# EAGLE design mainboard_v3 (EAGLE 9.6.2)

## Sheet 1 of 2
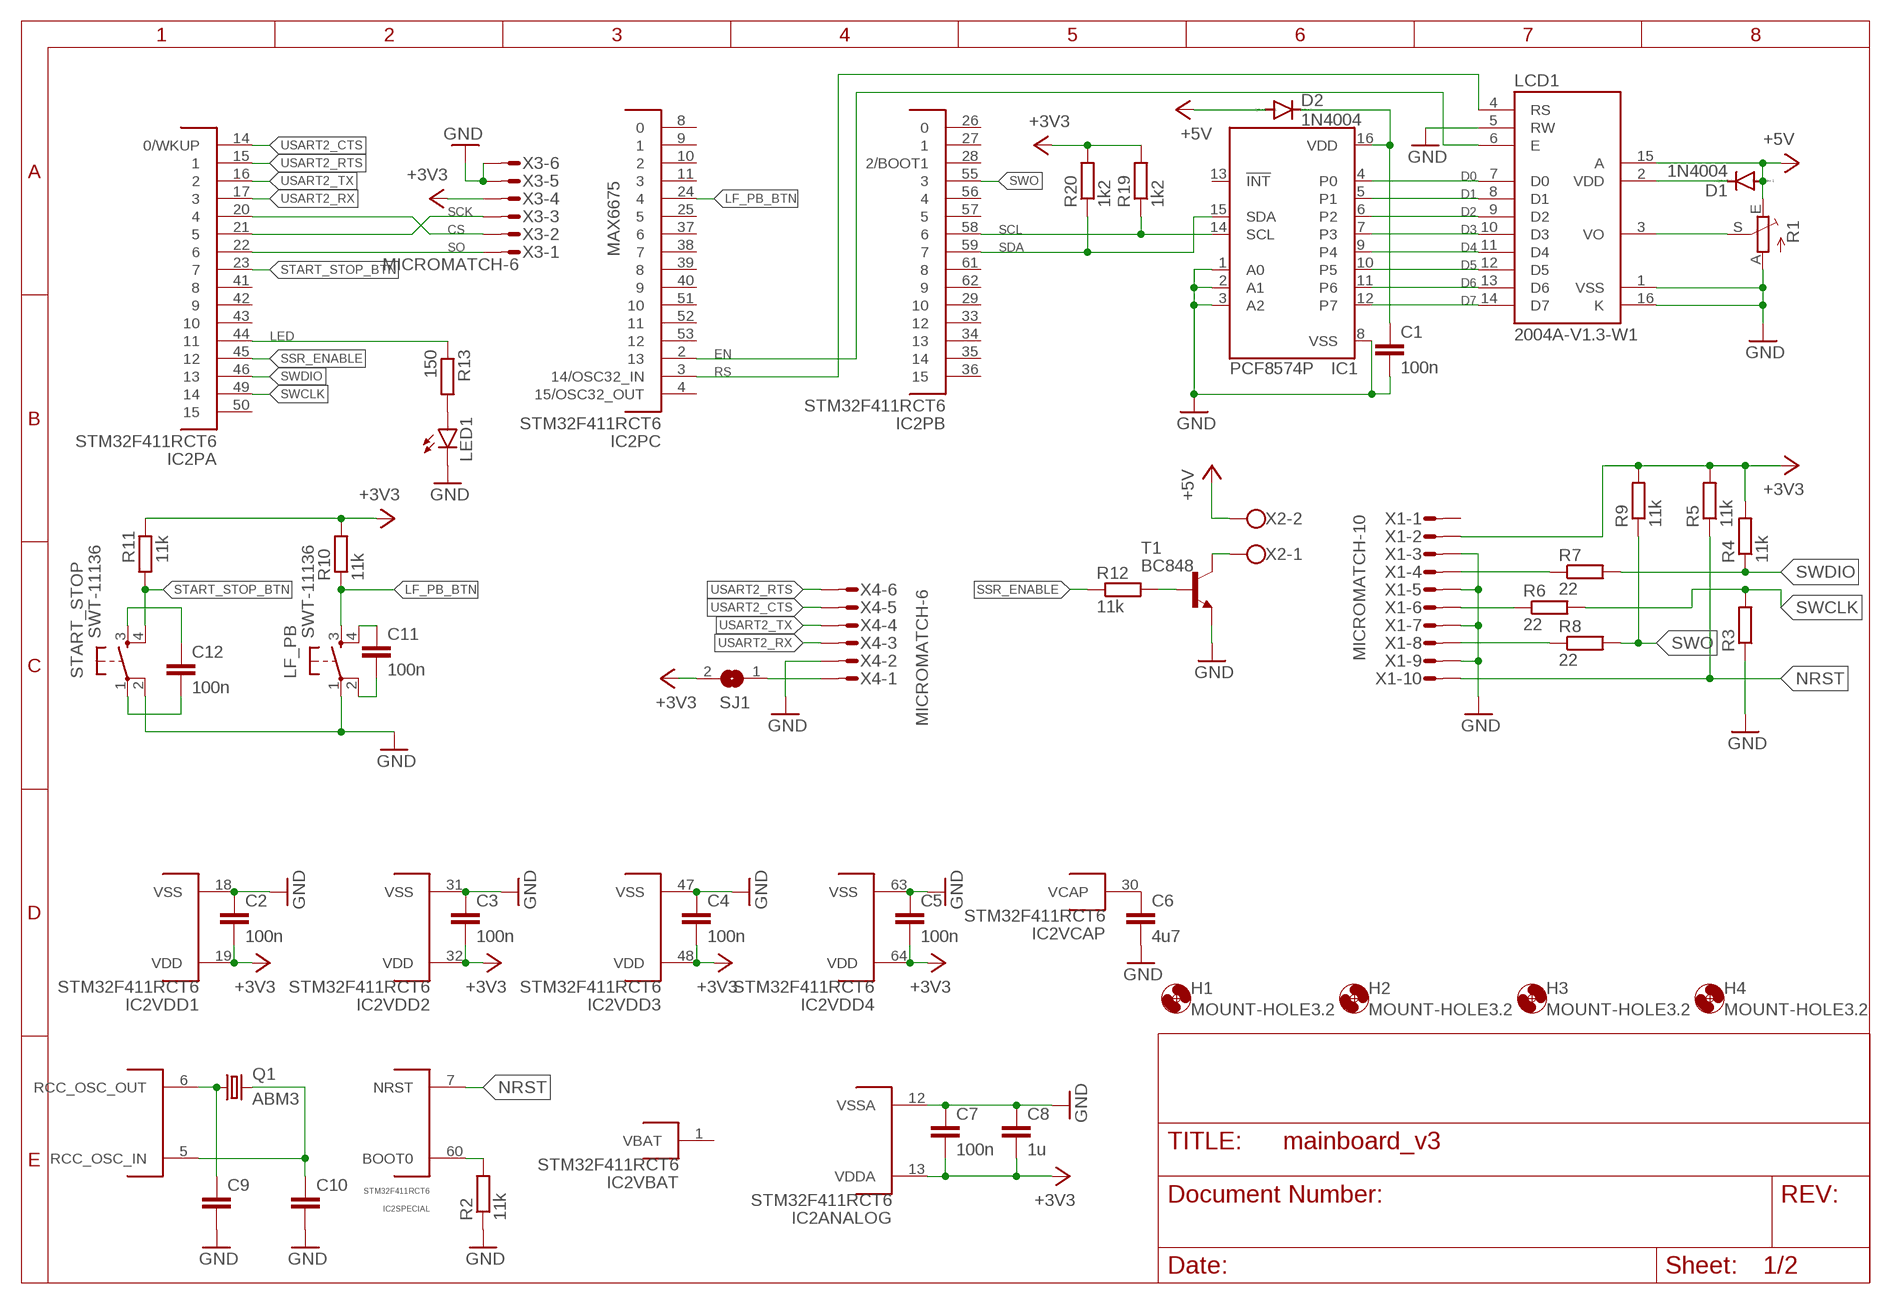
[diagram p0: schematic, sheet 1]

### Parts
C1  100n  C-EUC0805  [C0805]
C2  100n  C-EUC0805  [C0805]
C3  100n  C-EUC0805  [C0805]
C4  100n  C-EUC0805  [C0805]
C5  100n  C-EUC0805  [C0805]
C6  4u7  C-EUC0805  [C0805]
C7  100n  C-EUC0805  [C0805]
C8  1u  C-EUC0805  [C0805]
C9  C-EUC0805  [C0805]
C10  C-EUC0805  [C0805]
C11  100n  C-EUC0805  [C0805]
C12  100n  C-EUC0805  [C0805]
D1  1N4004  [DO41-10]
D2  1N4004  [DO41-10]
H1  MOUNT-HOLE3.2  [3,2]
H2  MOUNT-HOLE3.2  [3,2]
H3  MOUNT-HOLE3.2  [3,2]
H4  MOUNT-HOLE3.2  [3,2]
IC1  PCF8574P  [DIL16]
IC2  STM32F411RCT6  [QFP50P1200X1200X160-64N]
LCD1  2004A-V1.3-W1  [2004A-V1.3-W1]
LED1  LED5MM  [LED5MM]
LF_PB  SWT-11136  [SWT-11136]
Q1  ABM3  [XTALDFN500X320X130-2N]
R1  TRIM_EU-CA9V  [CA9V]
R2  11k  R-EU_R1206  [R1206]
R3  R-EU_R1206  [R1206]
R4  11k  R-EU_R1206  [R1206]
R5  11k  R-EU_R1206  [R1206]
R6  22  R-EU_R0603  [R0603]
R7  22  R-EU_R0603  [R0603]
R8  22  R-EU_R0603  [R0603]
R9  11k  R-EU_R1206  [R1206]
R10  11k  R-EU_R1206  [R1206]
R11  11k  R-EU_R1206  [R1206]
R12  11k  R-EU_R1206  [R1206]
R13  150  R-EU_R0805  [R0805]
R19  1k2  R-EU_0207/12  [0207/12]
R20  1k2  R-EU_0207/12  [0207/12]
SJ1  SJ  [SJ]
START_STOP  SWT-11136  [SWT-11136]
T1  BC848  [SOT23]
X1  MICROMATCH-10  [MICROMATCH-10]
X2  W237-102  [W237-102]
X3  MICROMATCH-6  [MICROMATCH-6]
X4  MICROMATCH-6  [MICROMATCH-6]

### Nets
+3V3 [power]: C2.2 C3.2 C4.2 C5.2 C7.2 C8.2 IC2.13(ANALOG:VDDA) IC2.19(VDD1:VDD) IC2.32(VDD2:VDD) IC2.48(VDD3:VDD) IC2.64(VDD4:VDD) R4.2 R5.2 R9.2 R10.2 R11.2 R19.2 R20.2 SJ1.2 X1.2 X3.4 ; also sheet 2
+5V [power]: D1.A D2.A LCD1.15(A) R1.E X2.2 ; also sheet 2
CS [signal]: IC2.20 X3.2
D0 [signal_wide]: IC1.4(P0) LCD1.7(D0)
D1 [signal_wide]: IC1.5(P1) LCD1.8(D1)
D2 [signal_wide]: IC1.6(P2) LCD1.9(D2)
D3 [signal_wide]: IC1.7(P3) LCD1.10(D3)
D4 [signal_wide]: IC1.9(P4) LCD1.11(D4)
D5 [signal_wide]: IC1.10(P5) LCD1.12(D5)
D6 [signal_wide]: IC1.11(P6) LCD1.13(D6)
D7 [signal_wide]: IC1.12(P7) LCD1.14(D7)
EN [signal]: IC2.2 LCD1.6(E)
GND: C1.2 C2.1 C3.1 C4.1 C5.1 C6.2 C7.1 C8.1 C9.2 C10.2 IC1.1(A0) IC1.2(A1) IC1.3(A2) IC1.8(VSS) IC2.12(ANALOG:VSSA) IC2.18(VDD1:VSS) IC2.31(VDD2:VSS) IC2.47(VDD3:VSS) IC2.63(VDD4:VSS) LCD1.1(VSS) LCD1.5(RW) LCD1.16(K) LED1.K(C) LF_PB.1(P) R1.A R2.1 R3.1 START_STOP.2(P1) T1.2(E) X1.3 X1.5 X1.7 X1.9 X3.5 X3.6 X4.2 ; also sheet 2
LED: IC2.44 R13.1
LF_PB_BTN [signal]: IC2.24 LF_PB.3(S) R10.1
N$1: IC2.60(SPECIAL:BOOT0) R2.2
N$3 [power]: C1.1 D2.C IC1.16(VDD)
N$4: C10.1 IC2.5(SPECIAL:RCC_OSC_IN) Q1.2
N$5: C9.1 IC2.6(SPECIAL:RCC_OSC_OUT) Q1.1
N$6: R7.1 X1.4
N$7: R6.1 X1.6
N$8: R8.1 X1.8
N$9 [power]: LCD1.3(VO) R1.S
N$10: C6.1 IC2.30(VCAP:VCAP)
N$11: T1.3(C) X2.1
N$12: R12.2 T1.1(B)
N$13: LED1.A R13.2
N$15: C12.2 START_STOP.1(P)
N$16: C11.2 LF_PB.2(P1)
N$17: C11.1 LF_PB.4(S1)
N$18: C12.1 START_STOP.3(S)
N$19 [power]: D1.C LCD1.2(VDD)
N$22: SJ1.1 X4.1
NRST [signal]: IC2.7(SPECIAL:NRST) R5.1 X1.10
RS [signal]: IC2.3(PC:14/OSC32_IN) LCD1.4(RS)
SCK [signal]: IC2.21 X3.3
SCL [signal]: IC1.14(SCL) IC2.58 R19.1
SDA [signal]: IC1.15(SDA) IC2.59 R20.1
SO [signal]: IC2.22 X3.1
SSR_ENABLE [signal]: IC2.45 R12.1
START_STOP_BTN [signal]: IC2.23 R11.1 START_STOP.4(S1)
SWCLK [signal]: IC2.49 R3.2 R6.2
SWDIO [signal]: IC2.46 R4.1 R7.2
SWO [signal]: IC2.55 R8.2 R9.1
USART2_CTS: IC2.14(PA:0/WKUP) X4.5
USART2_RTS: IC2.15 X4.6
USART2_RX: IC2.17 X4.3
USART2_TX: IC2.16 X4.4
Unconnected: IC1.13(!INT) IC2.4(PC:15/OSC32_OUT) IC2.8 IC2.9 IC2.10 IC2.11 IC2.25 IC2.26 IC2.27 IC2.28(PB:2/BOOT1) IC2.29 IC2.33 IC2.34 IC2.35 IC2.36 IC2.37 IC2.38 IC2.39 IC2.40 IC2.41 IC2.42 IC2.43 IC2.50 IC2.51 IC2.52 IC2.53 IC2.56 IC2.57 IC2.61 IC2.62 X1.1

### Notes on the sheet
- MAX6675

## Sheet 2 of 2
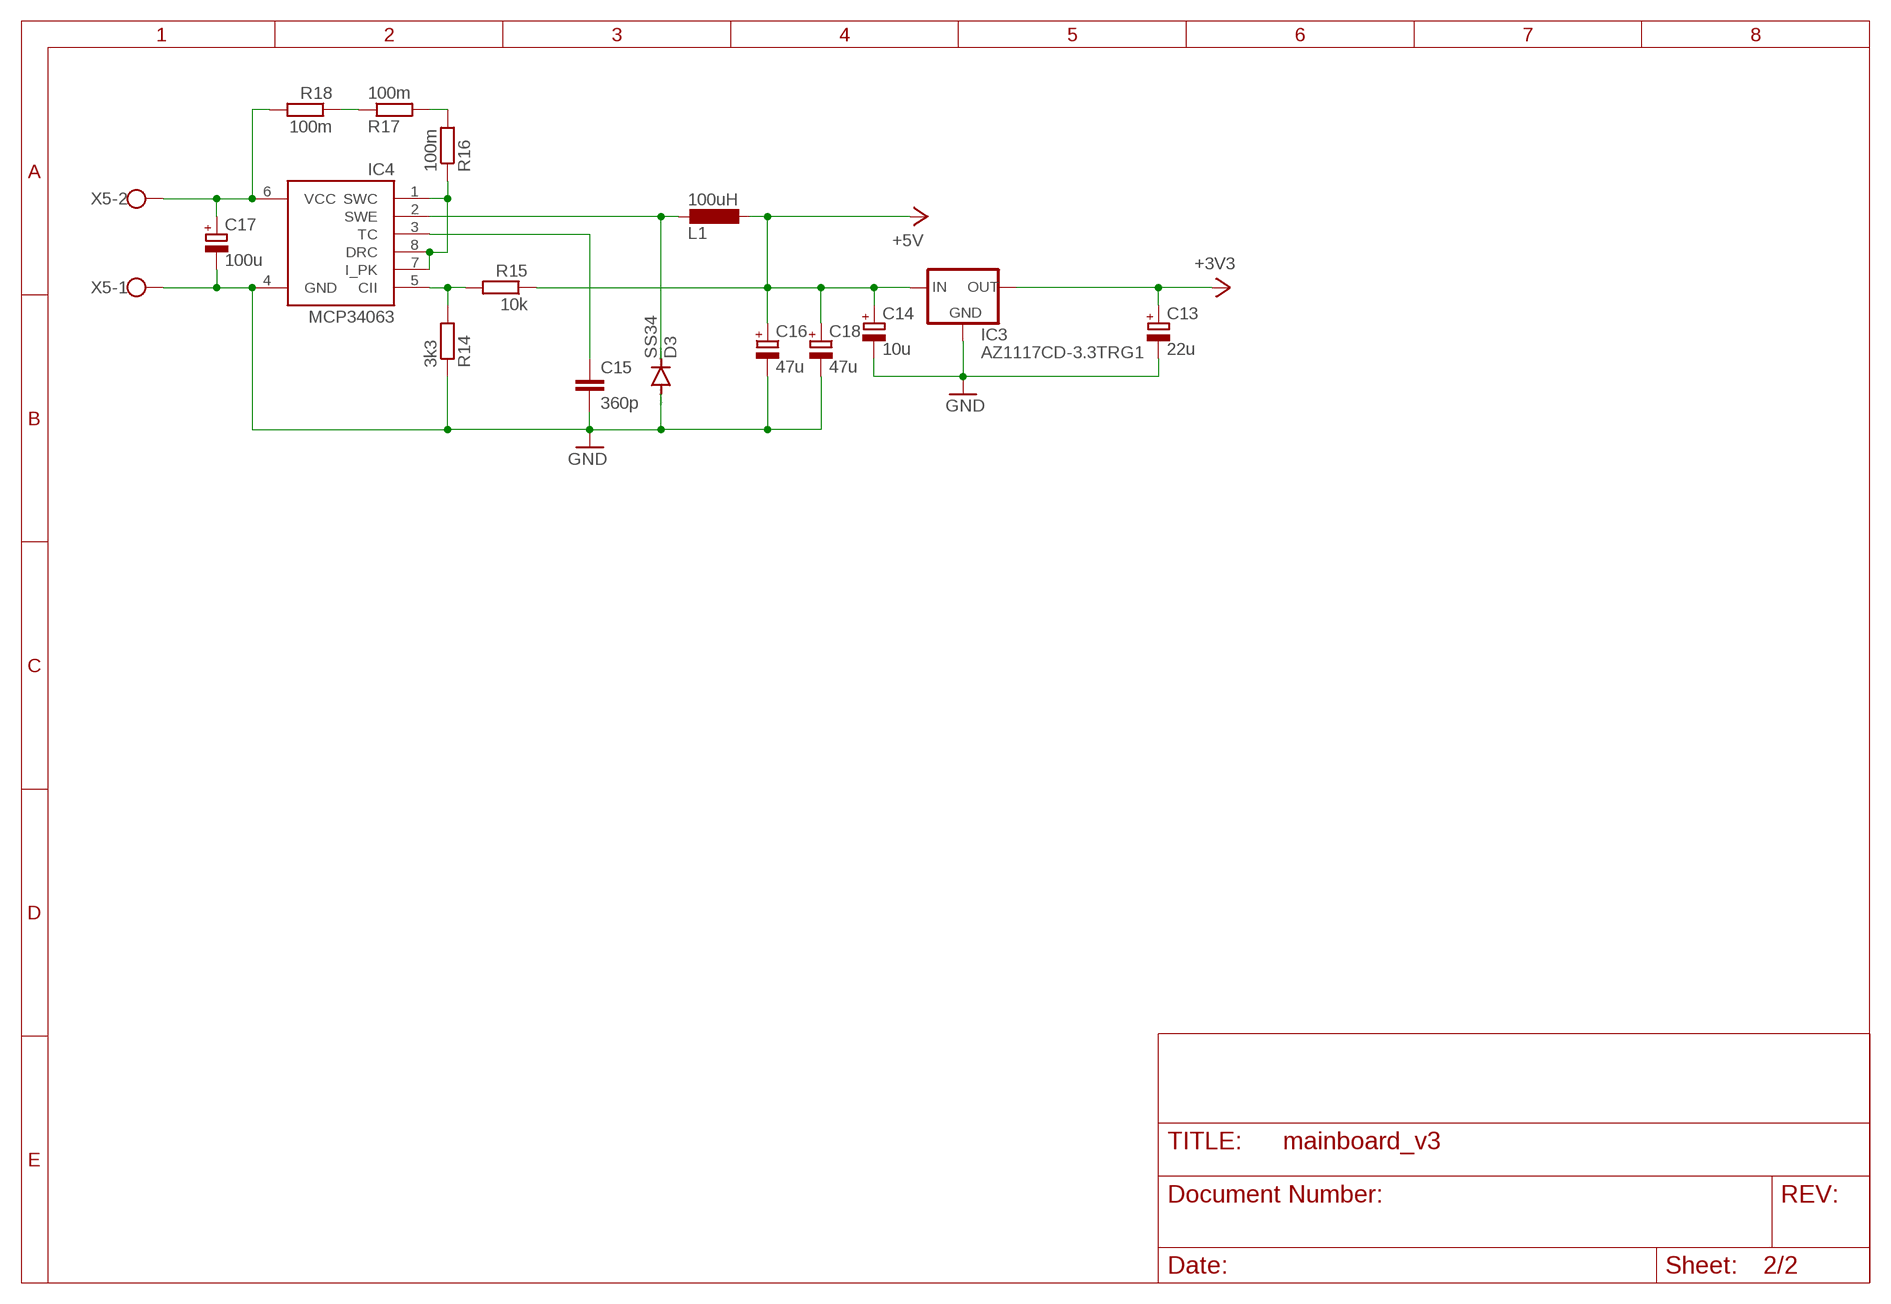
[diagram p1: schematic, sheet 2]

### Parts
C13  22u  CPOL-EUSMCB  [SMC_B]
C14  10u  CPOL-EUSMCA  [SMC_A]
C15  360p  C-EUC1206  [C1206]
C16  47u  CPOL-EUSMCD  [SMC_D]
C17  100u  CPOL-EUE5-8.5  [E5-8,5]
C18  47u  CPOL-EUSMCD  [SMC_D]
D3  SS34  DIODE-SMB  [SMB]
IC3  AZ1117CD-3.3TRG1  [TO228P1014X240-3N]
IC4  MCP34063  [SOIC127P600X175-8N]
L1  100uH  SOMETHING_100UH  [INDM7770X500N]
R14  3k3  R-EU_R1206  [R1206]
R15  10k  R-EU_R1206  [R1206]
R16  100m  R-EU_0309/12  [0309/12]
R17  100m  R-EU_0309/12  [0309/12]
R18  100m  R-EU_0309/12  [0309/12]
X5  W237-102  [W237-102]

### Nets
+3V3 [power]: C13.+ IC3.3(OUT) ; also sheet 1
+5V [power]: C14.+ C16.+ C18.+ IC3.2(IN) L1.1 R15.1 ; also sheet 1
GND: C13.- C14.- C15.2 C16.- C17.- C18.- D3.A IC3.1(GND) IC4.4(GND) R14.1 X5.1 ; also sheet 1
N$14 [power]: IC4.1(SWC) IC4.7(I_PK) IC4.8(DRC) R16.1
N$20: C15.1 IC4.3(TC)
N$21 [power]: D3.C IC4.2(SWE) L1.2
N$23 [power]: IC4.5(CII) R14.2 R15.2
N$24 [power]: R16.2 R17.2
N$25 [power]: R17.1 R18.1
N$26 [power]: C17.+ IC4.6(VCC) R18.2 X5.2

## Power pins joined to a net without a drawn wire
2: IC2.54
VBAT: IC2.1(VBAT:VBAT)

## Library data of the parts
C1-C12 C15 = rcl:C-EU: CAPACITOR, European symbol; SPICEPREFIX: C
C13 C14 C16-C18 = rcl:CPOL-EU: POLARIZED CAPACITOR, European symbol; SPICEPREFIX: C
D1 D2 = diode:1N4004: DIODE general purpose rectifier, 1 A
D3 = diode:DIODE-: DIODE
H1-H4 = holes:MOUNT-HOLE: MOUNTING HOLE with drill center marker
IC1 = micro-philips:PCF8574: I2C-Bus Remote 8-bit I/O expander http://www.semiconductors.philips.com/acrobat_download/datasheets/PCF8574_4.pdf; MPN: PCF8574PN; OC_FARNELL: 204020; OC_NEWARK: 11N8515
IC2 = microcontrolers:STM32F411RCT6: STM32F411xC STM32F411xE Arm Cortex-M4 32b MCU+FPU, 125 DMIPS, 512KB Flash, 128KB RAM, USB OTG FS, 11 TIMs, 1 ADC, 13 comm. interfaces
IC3 = voltage_regulators:AZ1117CD-3.3TRG1: AZ1117C - Low dropout linear regulator Description The AZ1117C is a low dropout three-terminal regulator. The AZ1117C has been optimized for low voltage where transient response and minimum input voltage are critical. It provides current limit and thermal shutdown. Its circuit includes a trimmed bandgap reference to assure output voltage accuracy to be within ±1%. Onchip thermal shutdown provides protection against a combination of high current and ambient temperature that would create excessive junction temperature. The AZ1117C is available in 1.2V, 1.5V, 1.8V, 2.5V, 3.3V, 5.0V fixed output voltage versions and ADJ output voltage version. The fixed versions integrate the adjust resistors. It is also available in an adjustable version which can set the output voltage with two external resistors.
IC4 = spectroscope:MCP34063: MC34063 - DC - DC converter IC
L1 = inductors:SOMETHING_100UH: unknown inductor 100µH
LCD1 = displays:2004A-V1.3-W1: 2004A - LCD screen with 20 character, 4 lines
LED1 = led:LED: LED OSRAM: - CHIPLED LG R971, LG N971, LY N971, LG Q971, LY Q971, LO R971, LY R971 LH N974, LH R974 LS Q976, LO Q976, LY Q976 LO Q996 - Hyper CHIPLED LW Q18S LB Q993, LB Q99A, LB R99A - SideLED LS A670, LO A670, LY A670, LG A670, LP A670 LB A673, LV A673, LT A673, LW A673 LH A674 LY A675 LS A676, LA A676, LO A676, LY A676, LW A676 LS A679, LY A679, LG A679 - Hyper Micro SIDELED® LS Y876, LA Y876, LO Y876, LY Y876 LT Y87S - SmartLED LW L88C, LW L88S LB L89C, LB L89S, LG L890 LS L89K, LO L89K, LY L89K LS L896, LA L896, LO L896, LY L896 - TOPLED LS T670, LO T670, LY T670, LG T670, LP T670 LSG T670, LSP T670, LSY T670, LOP T670, LYG T670 LG T671, LOG T671, LSG T671 LB T673, LV T673, LT T673, LW T673 LH T674 LS T676, LA T676, LO T676, LY T676, LB T676, LH T676, LSB T676, LW T676 LB T67C, LV T67C, LT T67C, LS T67K, LO T67K, LY T67K, LW E67C LS E67B, LA E67B, LO E67B, LY E67B, LB E67C, LV E67C, LT E67C LW T67C LS T679, LY T679, LG T679 LS T770, LO T770, LY T770, LG T770, LP T770 LB T773, LV T773, LT T773, LW T773 LH T774 LS E675, LA E675, LY E675, LS T675 LS T776, LA T776, LO T776, LY T776, LB T776 LHGB T686 LT T68C, LB T68C - Hyper Mini TOPLED® LB M676 - Mini TOPLED Santana® LG M470 LS M47K, LO M47K, LY M47K Source: http://www.osram.convergy.de LUXEON: - LUMILED® LXK2-PW12-R00, LXK2-PW12-S00, LXK2-PW14-U00, LXK2-PW14-V00 LXK2-PM12-R00, LXK2-PM12-S00, LXK2-PM14-U00 LXK2-PE12-Q00, LXK2-PE12-R00, LXK2-PE12-S00, LXK2-PE14-T00, LXK2-PE14-U00 LXK2-PB12-K00, LXK2-PB12-L00, LXK2-PB12-M00, LXK2-PB14-N00, LXK2-PB14-P00, LXK2-PB14-Q00 LXK2-PR12-L00, LXK2-PR12-M00, LXK2-PR14-Q00, LXK2-PR14-R00 LXK2-PD12-Q00, LXK2-PD12-R00, LXK2-PD12-S00 LXK2-PH12-R00, LXK2-PH12-S00 LXK2-PL12-P00, LXK2-PL12-Q00, LXK2-PL12-R00 Source: www.luxeon.com KINGBRIGHT: KA-3528ASYC Source: www.kingbright.com
LF_PB START_STOP = tact-switches:SWT-11136: SWT-11138 Tactile switch 12x12 mm
Q1 = microcontrolers:ABM3: ABM3 - 8 MHz crystal oscillator
R1 = pot:TRIM_EU-: POTENTIOMETER
R2-R20 = rcl:R-EU_: RESISTOR, European symbol; SPICEPREFIX: R
SJ1 = jumper:SJ: SMD solder JUMPER
T1 = transistor:BC848: NPN TRANSISTOR
X1 = con-amp-micromatch:MICROMATCH-10: MicroMaTch 10 8-215464-0 / 1-215464-0 Drawing Number C-215464 DDEController.pdf; MF: FARNELL; MPN: 8-215464-0; OC_FARNELL: 3784654; OC_NEWARK: 19J6430
X2 X5 = con-wago-500:W237-102: WAGO SCREW CLAMP; MPN: 237-102; OC_FARNELL: unknown; OC_NEWARK: 70K9898
X3 X4 = con-amp-micromatch:MICROMATCH-6: MicroMaTch 6 7-215464-6 / 0-215464-6 Drawing Number C-215464 DDEController.pdf; MPN: 7-215464-6; OC_FARNELL: 3784630; OC_NEWARK: 19R8125

## Net classes
1 signal_wide: width 0.406 mm, drill 0.6 mm, clearance 0.406 mm
2 signal: width 0.203 mm, drill 0.4 mm, clearance 0.203 mm
3 power: clearance 0.406 mm

## Board
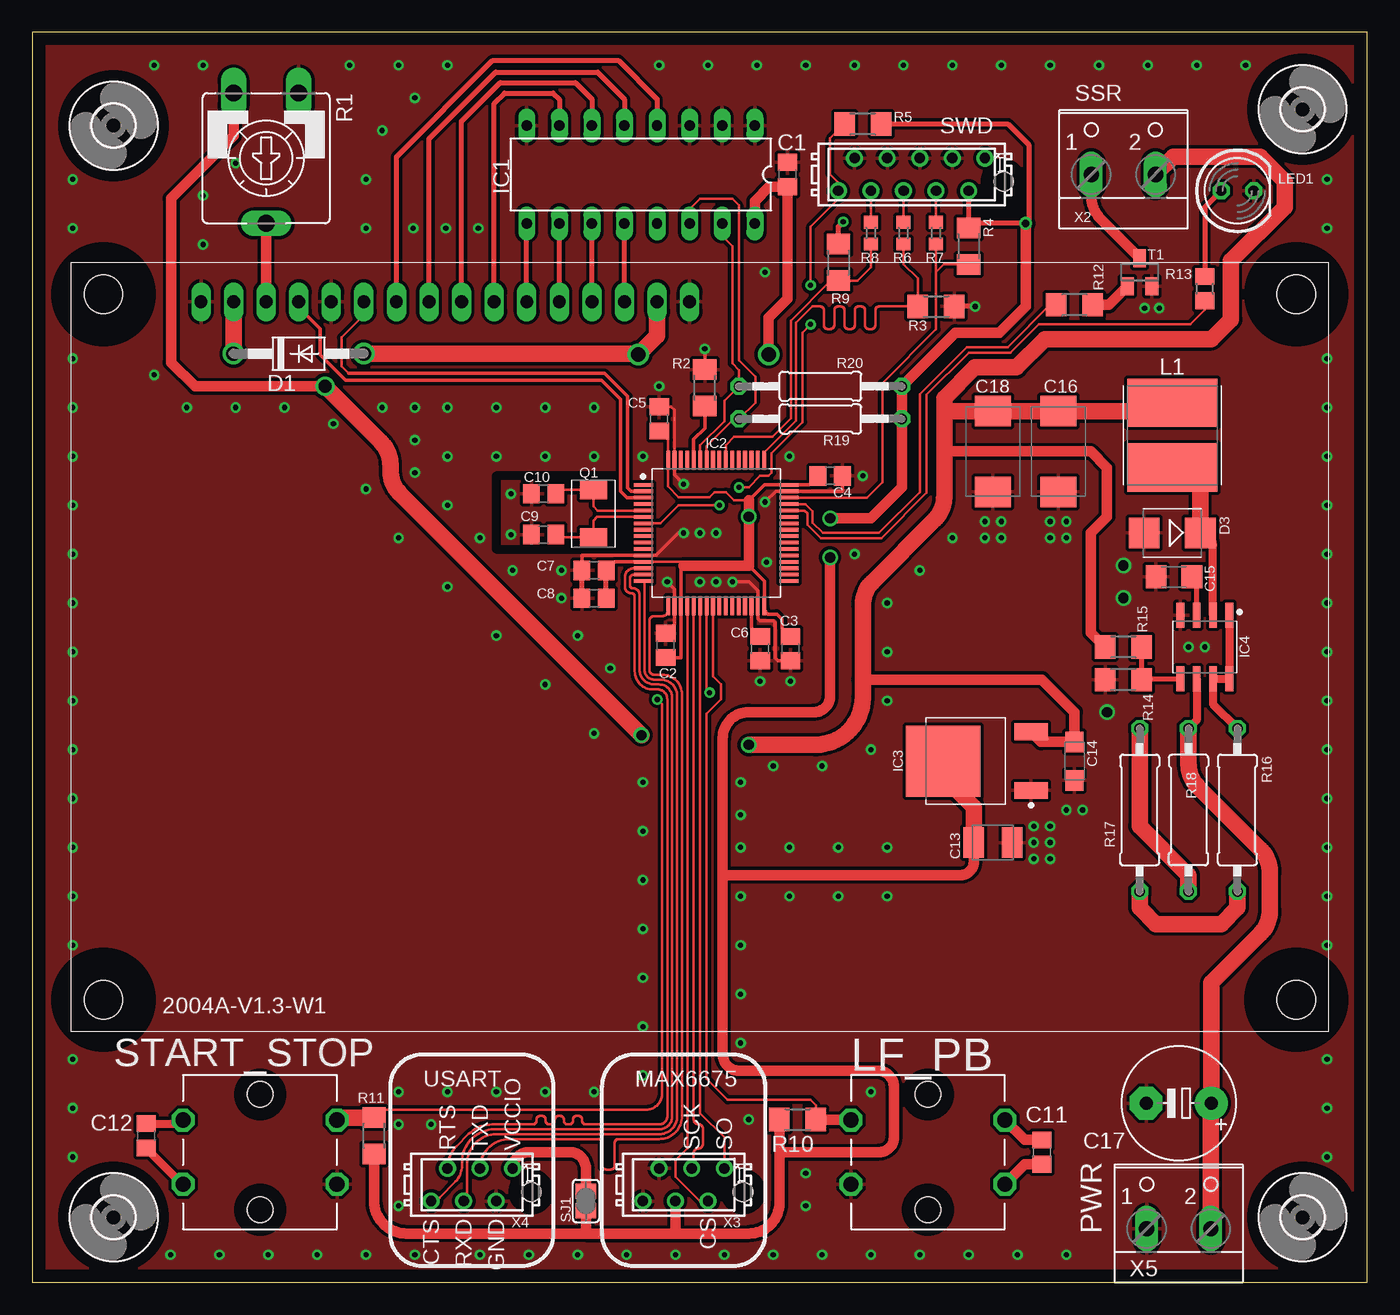
[diagram p2: board, top side]
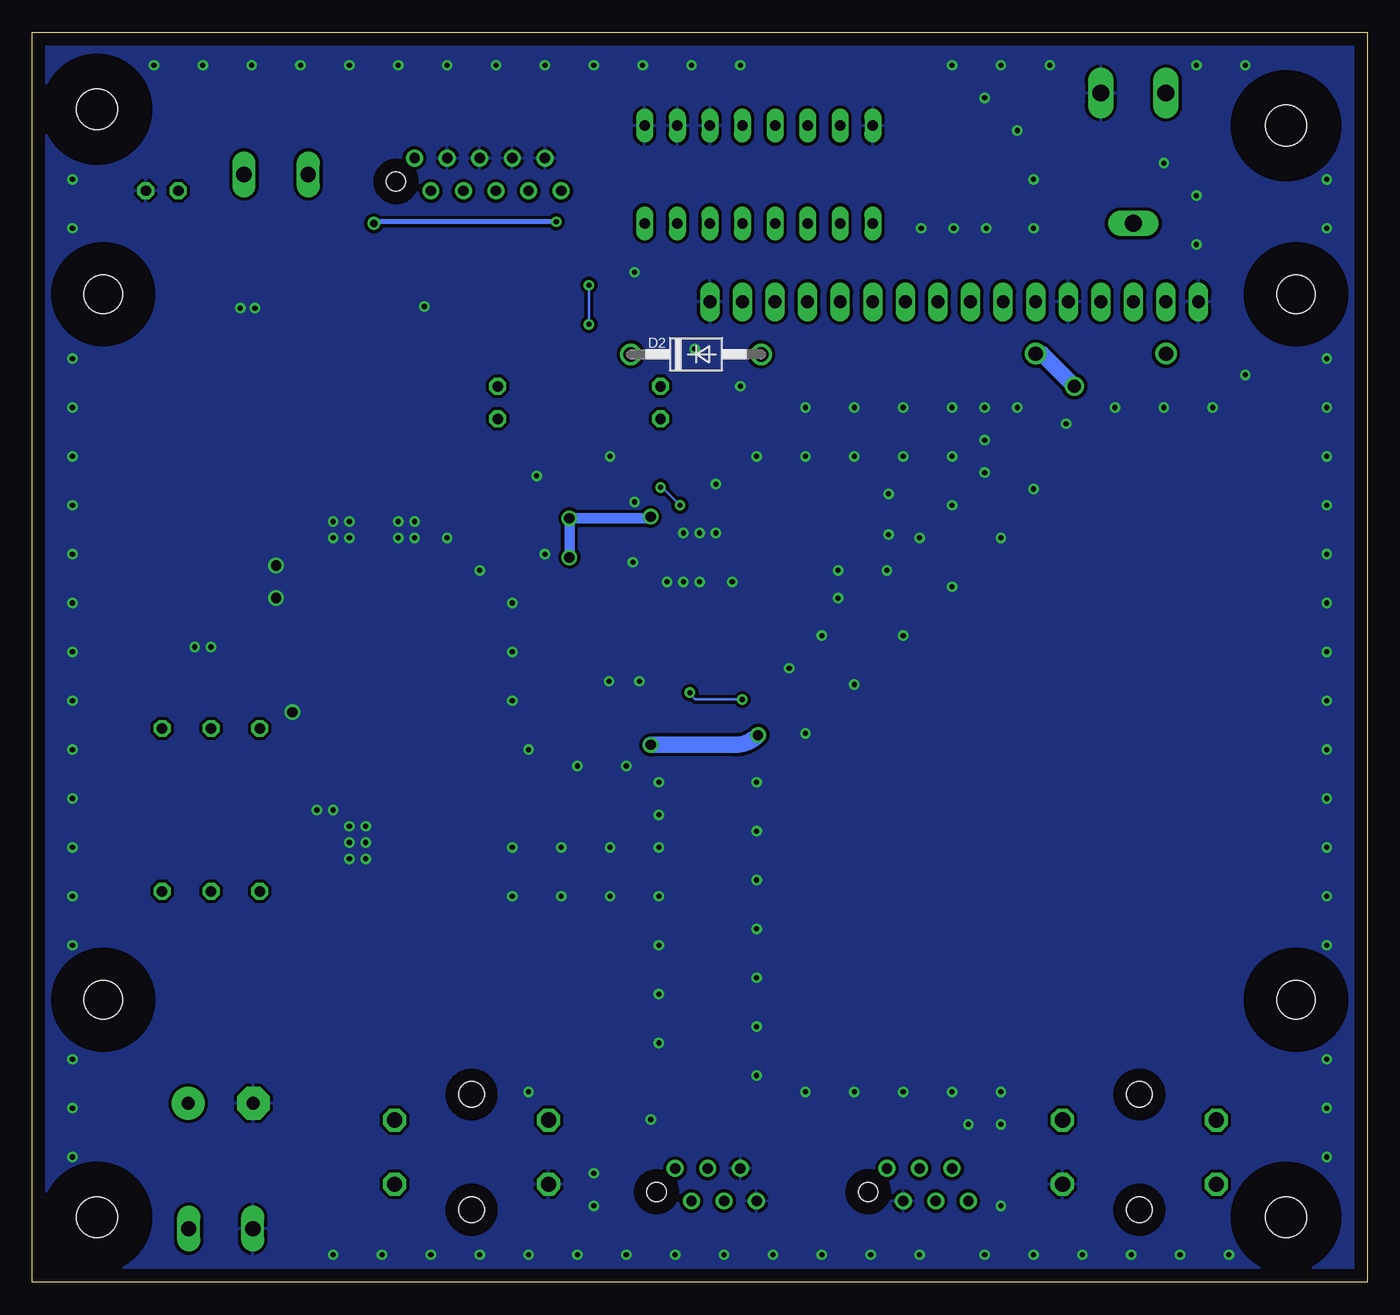
[diagram p3: board, bottom side, seen from below]

Size 104.12 x 97.46 mm. Coordinates in mm from the lower left corner, seen from the top.
Outline: 0,0 104.12,0 104.12,97.46 0,97.46 0,0
Copper layers (1*16): Top 0.035mm / dielectric 1.5mm / Bottom 0.035mm
Design rules "default *": minimum track width 6mil, minimum drill 0.35mm, track to track 6mil, track to pad 6mil, pad to pad 6mil, via to via 6mil, smd to smd 6mil, copper to edge 40mil, drill to drill 6mil, minimum pad ring 10mil, minimum via ring 8mil, stop-mask expansion 4mil, vias tented up to drill 0.4mm, thermal gap 10mil
tRestrict: 3 lines

### Footprints (pad centres in the part's own frame; a part is rotated, then mirrored left to right if it is on the bottom)
C0805 = smd 1.3 x 1.5: 1 -0.95,0; 2 0.95,0
SMC_B = smd 1.6 x 2.4: + -1.5,0; - 1.5,0
SMC_A = smd 1.6 x 1.4: + -1.5,0; - 1.5,0
C1206 = smd 1.6 x 1.8: 1 -1.4,0; 2 1.4,0
SMC_D = smd 2.4 x 2.8: + -3.15,0; - 3.15,0
E5-8,5 = drill 1.016 pad 2.54: + -2.54,0 | drill 1.016 pad 2.54 octagon: - 2.54,0
DO41-10 = drill 1.118: A 5.08,0; C -5.08,0
SMB = smd 2.4 x 2.4: A 2.2,0; C -2.2,0
3,2 = hole 3.2: 0,0
DIL16 = drill 0.813 long: 1 -8.89,-3.81; 2 -6.35,-3.81; 3 -3.81,-3.81; 4 -1.27,-3.81; 5 1.27,-3.81; 6 3.81,-3.81; 7 6.35,-3.81; 8 8.89,-3.81; 9 8.89,3.81; 10 6.35,3.81; 11 3.81,3.81; 12 1.27,3.81; 13 -1.27,3.81; 14 -3.81,3.81; 15 -6.35,3.81; 16 -8.89,3.81
QFP50P1200X1200X160-64N = smd 1.469 x 0.28: 1 -5.671,3.75; 2 -5.671,3.25; 3 -5.671,2.75; 4 -5.671,2.25; 5 -5.671,1.75; 6 -5.671,1.25; 7 -5.671,0.75; 8 -5.671,0.25; 9 -5.671,-0.25; 10 -5.671,-0.75; 11 -5.671,-1.25; 12 -5.671,-1.75; 13 -5.671,-2.25; 14 -5.671,-2.75; 15 -5.671,-3.25; 16 -5.671,-3.75; 33 5.671,-3.75; 34 5.671,-3.25; 35 5.671,-2.75; 36 5.671,-2.25; 37 5.671,-1.75; 38 5.671,-1.25; 39 5.671,-0.75; 40 5.671,-0.25; 41 5.671,0.25; 42 5.671,0.75; 43 5.671,1.25; 44 5.671,1.75; 45 5.671,2.25; 46 5.671,2.75; 47 5.671,3.25; 48 5.671,3.75 | smd 0.28 x 1.469: 17 -3.75,-5.671; 18 -3.25,-5.671; 19 -2.75,-5.671; 20 -2.25,-5.671; 21 -1.75,-5.671; 22 -1.25,-5.671; 23 -0.75,-5.671; 24 -0.25,-5.671; 25 0.25,-5.671; 26 0.75,-5.671; 27 1.25,-5.671; 28 1.75,-5.671; 29 2.25,-5.671; 30 2.75,-5.671; 31 3.25,-5.671; 32 3.75,-5.671; 49 3.75,5.671; 50 3.25,5.671; 51 2.75,5.671; 52 2.25,5.671; 53 1.75,5.671; 54 1.25,5.671; 55 0.75,5.671; 56 0.25,5.671; 57 -0.25,5.671; 58 -0.75,5.671; 59 -1.25,5.671; 60 -1.75,5.671; 61 -2.25,5.671; 62 -2.75,5.671; 63 -3.25,5.671; 64 -3.75,5.671
TO228P1014X240-3N = smd 2.594 x 1.302: 1 -4.231,2.286; 2 -4.231,-2.286 | smd 5.805 x 5.532: 3 2.625,0
SOIC127P600X175-8N = smd 1.968 x 0.602: 1 -2.473,1.905; 2 -2.473,0.635; 3 -2.473,-0.635; 4 -2.473,-1.905; 5 2.473,-1.905; 6 2.473,-0.635; 7 2.473,0.635; 8 2.473,1.905
INDM7770X500N = smd 3.762 x 7.012: 1 -2.525,0; 2 2.525,0
2004A-V1.3-W1 = drill 1 long: 1 -38.9,26.9; 2 -36.36,26.9; 3 -33.82,26.9; 4 -31.28,26.9; 5 -28.74,26.9; 6 -26.2,26.9; 7 -23.66,26.9; 8 -21.12,26.9; 9 -18.58,26.9; 10 -16.04,26.9; 11 -13.5,26.9; 12 -10.96,26.9; 13 -8.42,26.9; 14 -5.88,26.9; 15 -3.34,26.9; 16 -0.8,26.9 | hole 3: -46.5,27.5; 46.5,27.5; -46.5,-27.5; 46.5,-27.5
LED5MM = drill 0.813 octagon: A -1.27,0; K 1.27,0
SWT-11136 = drill 1.2 octagon: 1 -6,-2.5; 2 6,-2.5; 3 -6,2.5; 4 6,2.5 | hole 2: 0,4.5; 0,-4.5
XTALDFN500X320X130-2N = smd 1.412 x 2.112: 1 -1.85,0; 2 1.85,0
CA9V = drill 1.321 long: A -2.54,-5.08; E 2.54,-5.08; S 0,5.08
R1206 = smd 1.6 x 1.803: 1 -1.422,0; 2 1.422,0
R0603 = smd 1 x 1.1: 1 -0.85,0; 2 0.85,0
R0805 = smd 1.3 x 1.5: 1 -0.95,0; 2 0.95,0
0309/12 = drill 0.813 octagon: 1 -6.35,0; 2 6.35,0
0207/12 = drill 0.813 octagon: 1 -6.35,0; 2 6.35,0
SJ = smd 1.168 x 1.6: 1 -0.762,0; 2 0.762,0
SOT23 = smd 1 x 1.4: 1 -0.95,-1.1; 2 0.95,-1.1; 3 0,1.1
MICROMATCH-10 = drill 0.813: 1 5.715,1.27; 2 4.445,-1.27; 3 3.175,1.27; 4 1.905,-1.27; 5 0.635,1.27; 6 -0.635,-1.27; 7 -1.905,1.27; 8 -3.175,-1.27; 9 -4.445,1.27; 10 -5.715,-1.27 | hole 1.5: 7.16,-0.55
W237-102 = drill 1.194 long: 1 -2.5,-1.27; 2 2.5,-1.27
MICROMATCH-6 = drill 0.813: 1 3.175,1.27; 2 1.905,-1.27; 3 0.635,1.27; 4 -0.635,-1.27; 5 -1.905,1.27; 6 -3.175,-1.27 | hole 1.5: 4.63,-0.55

### Placement (x,y rotation side)
C1  58.89,86.36 90 top
C2  49.4,49.66 270 top
C3  59.13,49.4 90 top
C4  62.23,62.87 180 top
C5  48.9,67.31 270 top
C6  56.77,49.4 270 top
C7  43.81,55.5 0 top
C8  43.81,53.34 0 top
C9  39.88,58.29 180 top
C10  39.88,61.47 180 top
C11  78.74,10.16 270 top
C12  8.89,11.43 270 top
C13  74.93,34.29 0 top
C14  81.28,40.64 270 top
C15  89.03,54.99 180 top
C16  80.01,64.77 270 top
C17  89.41,13.97 180 top
C18  74.93,64.77 270 top
D1  20.79,72.39 0 top
D2  52.35,72.34 0 bottom
D3  88.9,58.42 180 top
H1  6.35,90.17 0 top
H2  99.06,91.44 0 top
H3  6.35,5.08 0 top
H4  99.06,5.08 0 top
IC1  47.46,86.36 180 top
IC2  53.34,58.42 0 top
IC3  73.66,40.64 180 top
IC4  91.44,49.53 270 top
L1  88.9,66.04 270 top
LCD1  52.07,49.53 0 top
LED1  93.98,85.09 0 top
LF_PB  69.85,10.16 0 top
Q1  43.76,59.92 90 top
R1  18.25,87.63 180 top
R2  52.45,69.72 270 top
R3  70.48,76.07 180 top
R4  73.03,80.77 90 top
R5  64.77,90.3 0 top
R6  67.94,81.79 270 top
R7  70.48,81.79 270 top
R8  65.41,81.79 270 top
R9  62.87,79.5 90 top
R10  59.69,12.7 180 top
R11  26.67,11.43 270 top
R12  81.28,76.2 0 top
R13  91.44,77.47 90 top
R14  85.09,46.99 0 top
R15  85.09,49.53 0 top
R16  93.98,36.83 270 top
R17  86.36,36.83 270 top
R18  90.17,36.83 90 top
R19  61.47,67.31 0 top
R20  61.47,69.85 0 top
SJ1  43.18,6.35 270 top
START_STOP  17.78,10.16 0 top
T1  86.36,78.74 0 top
X1  68.58,86.36 0 top
X2  85.09,87.63 0 top
X3  50.8,7.62 0 top
X4  34.29,7.62 0 top
X5  89.41,5.46 0 top

### Tracks (layer width: path | path; a pad name or v marks a point on that pad's centre or on a via)
+3V3  (via drill 0.4, 0.6, 0.8)
  Top 0.203: C5.2 49.59,65.67 IC2.64 49.59,62.04 50.42,61.21 52.83,61.21 53.21,61.59 54.1,61.59 54.74,60.96 55.88,60.96 | IC2.13 50.8,56.17 50.8,55.88
  Top 0.254: C2.2 50.59,48.71 IC2.19 50.59,55.67 50.8,55.88 | C3.2 58.47,51.01 58.47,51.69 58.06,52.09 57.38,52.09 57.09,52.38 IC2.32 57.09,54.67 55.88,55.88 | C4.2 60.59,62.17 IC2.48 57.09,62.17 55.88,60.96 | IC2.13 45.44,56.17 45.12,55.85
  Top 0.406: C8.2 C7.2 | R9.2 62.87,82.3 v63.25,82.68 | X1.2 R4.2 73.38,82.55 v77.47,82.55 77.71,82.55 77.71,88.66 76.07,90.3 R5.2
  Top 0.508: C7.2 45.12,55.85
  Top 0.813: 55.88,60.96 v55.88,59.69 55.88,55.88 50.8,55.88 | v62.23,59.56 65.41,59.56 67.82,61.98 R19.2 R20.2 72.01,74.04 75.44,74.04 77.47,76.07 v77.47,82.55 | v62.23,56.52 62.23,45.72 arc-90 60.96,44.45 55.88,44.45 arc90 53.85,42.42 53.85,31.75 | 53.85,31.75 53.85,17.78 arc90 55.12,16.51 65.93,16.51 arc-90 67.2,15.24 67.2,11.32 arc-90 66.04,10.16 58.27,10.16 | R10.2 58.27,10.16 | X3.4 50.16,3.81 | 50.16,3.81 55.88,3.81 arc90 58.27,6.2 58.27,10.16 | SJ1.2 43.18,3.81 | 43.18,3.81 50.16,3.81 | 43.18,3.81 29.21,3.81 arc-90 26.67,6.35 R11.2 | C13.+ 73.43,32.79 arc-90 72.39,31.75 53.85,31.75
  Top 1.27: C13.+ 73.43,37.06 71.03,39.45 IC3.3
  Bottom 0.406: v63.25,82.68 77.34,82.68 v77.47,82.55
  Bottom 0.813: v55.88,59.69 56.01,59.56 v62.23,59.56 v62.23,56.52
+5V  (via drill 0.8, 1)
  Top 0.813: v22.86,69.85 12.7,69.85 10.85,71.7 10.85,84.51 15.71,89.37 R1.E | R15.1 82.55,50.65 82.55,58.42 83.82,59.69 83.82,63.5 82.55,64.77 71.12,64.77 | 64.77,46.99 78.74,46.99 81.28,44.45 C14.+ 78.68,42.14 77.93,42.88 | L1.1 88.25,67.92 85.09,67.92
  Top 1.27: LCD1.15 48.73,73.8 D2.A 47.22,72.39 D1.A | 77.93,42.88 IC3.2 | v55.88,41.91 61.09,41.91 arc90 64.77,45.59 64.77,46.99 64.77,52.8 arc-45 65.51,54.59 70.38,59.45 arc45 71.12,61.25 71.12,64.77 71.12,67.92 | v47.52,42.65 28.67,61.5 arc-45 27.94,63.27 27.94,63.72 arc45 27.2,65.51 v22.86,69.85 | 71.12,67.92 C18.+ C16.+ 85.09,67.92 87.31,67.92 | 71.12,67.92 71.12,68.93 73.52,71.32 76.75,71.32 78.96,73.53 91.95,73.53 93.47,75.06 93.47,79.63 97.66,83.82 97.66,85.85 95.76,87.76 88.99,87.76 X2.2
  Bottom 1.27: v22.86,69.85 25.4,72.39 D1.A | v47.52,42.65 v47.53,42.64 arc45 49.3,41.91 v55.88,41.91
CS
  Top 0.203: X3.2 52.07,6.35 50.16,8.26 50.16,9.53 51.09,10.45 IC2.20
D0
  Top 0.406: LCD1.7 28.41,87.74 35.92,95.25 45.72,95.25 48.73,92.24 IC1.4
D1
  Top 0.406: LCD1.8 30.95,89.13 36.16,94.34 44.09,94.34 46.19,92.24 IC1.5
D2
  Top 0.406: LCD1.9 33.49,90.52 36.49,93.52 42.37,93.52 43.65,92.24 IC1.6
D3
  Top 0.406: LCD1.10 36.03,91.91 36.83,92.71 40.64,92.71 41.11,92.24 IC1.7
D4
  Top 0.406: LCD1.11 IC1.9
D5
  Top 0.406: LCD1.12 IC1.10
D6
  Top 0.406: LCD1.13 IC1.11
D7
  Top 0.406: LCD1.14 IC1.12
EN
  Top 0.203: LCD1.6 25.87,75.4 24.13,73.66 24.13,71.4 24.66,70.87
  Top 0.254: IC2.2 46.69,61.67 46.43,61.92 46.43,69.06 44.63,70.87 24.66,70.87
GND  (via drill 0.4, 0.8)
  Top 0.203: IC2.63 50.09,68.01 49.84,68.26 C5.1
  Top 0.254: C2.1 50.09,51.29 IC2.18 50.09,54.05 v49.53,54.61 | C3.1 58.18,48.45 57.94,48.69 57.94,51.46 57.81,51.59 56.74,51.59 56.59,51.74 IC2.31 56.59,53.9 55.88,54.61 v54.61,54.61 | C4.1 63.18,61.67 IC2.47 57.99,61.67 v57.15,60.83 | C7.1 42.87,56.67 IC2.12 48.67,56.67 50.42,58.42 | R2.1 v52.45,72.77 | IC2.63 50.09,62.94 v50.8,62.23
  Top 0.406: C8.1 C7.1 | v73.53,76.07 R3.1
  other vias: 48.9,69.85 64.77,62.87 56.77,46.86 59.13,46.86 53.34,54.61 52.07,54.61 57.28,56.13 50.8,58.42 41.27,55.5 41.27,53.34 37.34,61.47 37.34,58.29 87.88,75.95 86.74,75.95 78.11,33.02 78.11,34.29 78.11,35.56 79.38,35.56 79.38,34.29 79.38,33.02 80.64,36.83 81.92,36.83 85.09,55.88 85.09,53.34 57.15,78.74 29.72,82.17 32.26,82.17 34.8,82.17 55.88,12.7 83.82,44.45 90.17,49.53 91.44,49.53 43.81,64.39 40.01,64.39 3.17,72.01 3.17,64.39 3.17,68.2 3.17,60.58 3.17,56.77 3.17,52.96 3.17,49.15 3.17,45.34 3.17,41.53 3.17,37.72 3.17,33.91 3.17,30.1 3.17,26.29 3.17,17.4 3.17,13.59 3.17,9.78 10.79,2.16 14.61,2.16 18.41,2.16 22.23,2.16 26.04,2.16 29.84,2.16 34.92,2.16 38.73,2.16 42.55,2.16 46.35,2.16 50.16,2.16 53.98,2.16 57.78,2.16 61.59,2.16 65.41,2.16 69.22,2.16 73.03,2.16 76.83,2.16 80.64,2.16 100.97,9.78 100.97,13.59 100.97,17.4 100.97,26.29 100.97,30.1 100.97,33.91 100.97,37.72 100.97,41.53 100.97,45.34 100.97,49.15 100.97,52.96 100.97,56.77 100.97,60.58 100.97,64.39 100.97,68.2 100.97,72.01 100.97,82.17 100.97,85.98 94.61,94.87 90.81,94.87 87,94.87 83.19,94.87 79.38,94.87 75.56,94.87 71.75,94.87 67.94,94.87 64.14,94.87 60.33,94.87 56.52,94.87 52.7,94.87 48.9,94.87 32.38,94.87 28.57,94.87 24.77,94.87 13.34,94.87 9.53,94.87 3.17,82.17 3.17,85.98 47.62,38.99 47.62,35.18 47.62,31.37 47.62,27.56 47.62,23.75 47.62,19.94 47.62,16.13 55.24,18.67 55.24,22.48 55.24,26.29 55.24,30.1 55.24,33.91 55.24,36.45 55.24,38.99 59.05,33.91 62.87,33.91 66.67,33.91 66.67,30.1 62.87,30.1 59.05,30.1 71.75,58.04 69.22,55.5 66.67,52.96 66.67,49.15 66.67,45.34 65.41,41.53 61.59,40.26 57.78,40.26 64.14,56.77 59.05,64.39 47.62,64.39 52.07,58.42 53.34,58.42 43.81,14.86 40.01,14.86 36.2,14.86 32.38,14.86 28.57,14.86 28.57,12.32 31.11,12.32 28.57,5.97 60.33,8.51 60.33,5.97 29.84,92.33 27.3,89.79 26.04,85.98 26.04,82.17 75.56,59.31 74.3,59.31 79.38,59.31 80.64,59.31 75.56,58.04 74.3,58.04 79.38,58.04 80.64,58.04 43.81,42.8 40.01,46.61 36.2,50.42 32.38,54.23 28.57,58.04 26.04,61.85 23.5,66.93 27.3,68.2 29.84,65.66 29.84,63.12 32.38,60.58 34.92,58.04 37.47,55.5 42.55,50.42 45.09,47.88 43.81,68.2 40.01,68.2 36.2,68.2 32.38,68.2 29.84,68.2 36.2,64.39 32.38,64.39 19.68,68.2 15.88,68.2 12.06,68.2 9.53,70.74 13.34,80.9 13.34,84.71 15.88,87.25 65.41,14.86
  pour Top (isolate 0.254): 0,97.79 104.14,97.79 104.14,0 0,0
  pour Bottom (isolate 0.254): 0,97.79 104.14,97.79 104.14,0 0,0
LED
  Top 0.203: IC2.44 60.23,60.17 60.45,59.94 60.45,59.05 61.49,58.01 66.21,58.01 69.75,61.55 69.75,69.17 73.04,72.47 76.28,72.47 78.49,74.68 90.3,74.68 91.44,75.82 R13.1
LF_PB_BTN
  Top 0.203: IC2.24 53.09,47.24 53.72,46.61 53.72,45.47 52.58,44.32 52.58,15.88 54.23,14.22 60.71,14.22 61.11,13.82 R10.1
  Top 0.813: R10.1 63.81,12.7 LF_PB.3
N$1
  Top 0.254: R2.2 52.45,66.59 51.59,65.73 IC2.60
N$3
  Top 0.813: IC1.16 56.35,84.29 57.47,85.41 C1.1 58.89,76.67 57.43,75.21 D2.C
N$4
  Top 0.203: IC2.5 44.1,60.17 43.76,60.5 Q1.2 41.13,61.77 C10.1
N$5
  Top 0.203: IC2.6 44.05,59.67 43.76,59.38 Q1.1 41.05,58.07 C9.1
N$6
  Top 0.203: R7.1 X1.4
N$7
  Top 0.203: R6.1 X1.6
N$8
  Top 0.203: R8.1 X1.8
N$9
  Top 0.813: LCD1.3 R1.S
N$10
  Top 0.254: IC2.30 56.09,51.03 C6.1
N$11
  Top 0.813: X2.1 82.59,84.66 arc45 83.33,82.87 T1.3
N$12
  Top 0.813: R12.2 83.97,76.2 T1.1
N$13
  Top 0.406: LED1.A 91.44,83.82 R13.2
N$14
  Top 0.61: R16.1 92.08,45.09 IC4.7 IC4.8 IC4.1
N$15
  Top 0.61: C12.2 11.71,7.66 START_STOP.1
N$16
  Top 0.813: C11.2 77.4,9.21 LF_PB.2
N$17
  Top 0.813: C11.1 77.4,11.11 LF_PB.4
N$18
  Top 0.61: C12.1 11.5,12.38 START_STOP.3
N$19
  Top 1.27: D1.C LCD1.2
N$20
  Top 0.406: IC4.3 90.81,54.61 C15.1
N$21
  Top 0.61: IC4.2 92.08,57.45 arc90 D3.C
  Top 1.27: D3.C 91.1,63.16 arc-90 91.44,63.5 arc90 91.42,63.52 L1.2
N$22
  Top 0.813: X4.1 arc-90 38.73,10.16 41.91,10.16 arc-90 43.18,8.89 SJ1.1
N$23
  Top 0.406: IC4.5 86.67,47.06 arc45 R14.2 R15.2
N$24
  Top 1.27: R16.2 93.98,29.21 92.71,27.94 87.63,27.94 86.36,29.21 R17.2
N$25
  Top 1.27: R17.1 86.36,35.56 90.17,31.75 R18.1
N$26
  Top 0.61: IC4.6 90.81,43.81 R18.2
  Top 1.27: R18.2 90.17,40.42 arc45 90.91,38.63 95.78,33.76 arc-45 96.52,31.97 96.52,28.99 arc-45 95.78,27.2 91.95,23.37 C17.+ 91.91,13.93 X5.2
NRST  (via drill 0.4)
  Top 0.203: R5.1 62.23,89.18 62.23,86.36 62.87,85.72 X1.10 62.87,84.45 60.71,82.3 v60.71,77.72 | IC2.7 49.01,59.17 50.42,60.58 v53.59,60.58 | v60.71,74.68 60.07,74.04 60.07,67.06 57.66,64.64 57.66,63.12 57.4,62.87 56.77,62.87 55.88,61.98 v55.12,61.98
  Bottom 0.203: v55.12,61.98 54.99,61.98 v53.59,60.58 | v60.71,74.68 v60.71,77.72
RS
  Top 0.254: LCD1.4 20.79,76 22.47,74.32 22.47,72.3 24.46,70.31 44.42,70.31 45.9,68.83 45.9,61.66 46.39,61.17 IC2.3
SCK
  Top 0.203: X3.3 51.59,9.04 51.59,10.09 arc-90 51.95,10.44 arc90 52.3,10.8 52.3,11.99 arc90 51.95,12.34 arc-90 51.59,12.7 IC2.21
SCL
  Top 0.203: IC1.14 51.27,83.66 52.07,84.45 54.61,84.45 55.12,83.95 55.12,71.88 56.39,70.61 56.39,68.58 R19.1 54.74,67.31 52.59,65.16 IC2.58
SDA
  Top 0.203: IC1.15 53.81,81.57 54.61,80.77 54.61,71.63 55.12,71.12 R20.1 53.98,68.71 53.98,67.12 52.09,65.24 IC2.59
SO
  Top 0.203: X3.1 53.98,11.3 52.09,13.19 IC2.22
SSR_ENABLE
  Top 0.203: IC2.45 60.3,60.67 60.86,60.11 60.86,59.22 61.66,58.42 66.04,58.42 69.22,61.59 69.22,69.22 72.9,72.9 76.07,72.9 79.38,76.2 R12.1
START_STOP_BTN  (via drill 0.4)
  Top 0.203: IC2.23 52.59,46.22 v52.83,45.97 | v48.75,45.44 49.12,45.07 49.12,14.73 arc-90 47.85,13.46 27.28,13.46 R11.1
  Top 1.27: R11.1 23.97,12.85 START_STOP.4
  Bottom 0.203: v52.83,45.97 52.83,45.85 52.43,45.44 v48.75,45.44
SWCLK
  Top 0.203: R6.2 67.94,79.38 69.06,78.26 R3.2 66.04,76.07 arc90 65.75,75.78 65.75,74.61 arc-90 65.46,74.31 65.24,74.31 arc-90 64.95,74.61 64.95,75.78 arc90 64.66,76.07 64.44,76.07 arc90 64.15,75.78 64.15,74.61 arc-90 63.85,74.31 63.64,74.31 arc-90 63.34,74.61 63.34,75.78 arc90 63.05,76.07 62.84,76.07 arc90 62.55,75.78 62.55,74.61 arc-90 62.25,74.31 62.04,74.31 arc-90 61.74,74.61 61.74,75.78 arc90 61.45,76.07 60.83,76.07 59.56,74.8 59.56,67.18 57.09,64.71 IC2.49
SWDIO
  Top 0.203: R7.2 70.48,78.74 | 70.48,78.74 70.48,74.3 66.29,70.1 66.29,62.36 65.11,61.17 IC2.46 | R4.1 71.09,79.35 70.48,78.74
SWO
  Top 0.203: R8.2 65.41,79.12 64.36,78.08 R9.1 62.27,78.08 59.16,74.97 59.16,67.35 57.72,65.91 54.74,65.91 54.09,65.27 IC2.55
USART2_CTS
  Top 0.203: IC2.14 46.91,55.67 arc90 46.23,54.99 46.23,54.23 arc90 46.74,53.72 arc-90 46.99,53.47 46.99,47.62 arc90 48.39,46.23 48.77,46.23 arc-90 49.53,45.47 49.53,12.95 arc-90 48.9,12.32 43.18,12.32 arc-90 42.89,12.61 42.89,12.69 arc90 42.6,12.98 42.47,12.98 arc90 42.18,12.69 42.18,12.61 arc-90 41.88,12.32 41.76,12.32 arc-90 41.47,12.61 41.47,12.69 arc90 41.17,12.98 41.05,12.98 arc90 40.76,12.69 40.76,12.61 arc-90 40.46,12.32 40.34,12.32 arc-90 40.04,12.61 40.04,12.69 arc90 39.75,12.98 39.62,12.98 arc90 39.33,12.69 39.33,12.61 arc-90 39.04,12.32 35.85,12.32 arc45 34.05,11.57 33.1,10.62 arc45 X4.5
USART2_RTS
  Top 0.203: IC2.15 46.91,55.17 arc90 46.61,54.86 46.61,54.36 arc90 46.86,54.1 arc-90 47.37,53.59 47.37,47.75 arc90 48.51,46.61 48.9,46.61 arc-90 49.91,45.59 49.91,12.95 arc-90 48.9,11.94 36.07,11.94 arc90 33.53,9.4 33.53,9.1 arc-45 33.02,7.87 31.77,6.62 arc-45 X4.6
USART2_RX
  Top 0.203: IC2.17 49.59,52.38 arc-90 49.15,51.94 48.51,51.94 arc90 48.13,51.56 48.13,47.75 arc90 48.51,47.37 49.15,47.37 arc-90 50.67,45.85 50.67,12.95 arc-90 48.9,11.18 45.72,11.18 arc90 45.43,10.88 45.43,9.1 arc-90 45.14,8.81 44.74,8.81 arc-90 44.44,9.1 44.44,10.88 arc90 44.15,11.18 37.21,11.18 arc90 X4.3
USART2_TX
  Top 0.203: IC2.16 arc-90 47.75,54.59 47.75,47.75 arc90 48.51,46.99 49.02,46.99 arc-90 50.29,45.72 50.29,12.95 arc-90 48.9,11.56 36.2,11.56 arc90 33.91,9.27 33.91,6.6 arc-90 X4.4

### Text on the board
tPlace: SCK | SO | CS
tNames: SSR | SWD | 2004A-V1.3-W1 | USART | MAX6675 | RTS | TXD | VCCIO | CTS | RXD | GND | PWR